# Altium schematic sheet Simetrica.SchDoc
size A4
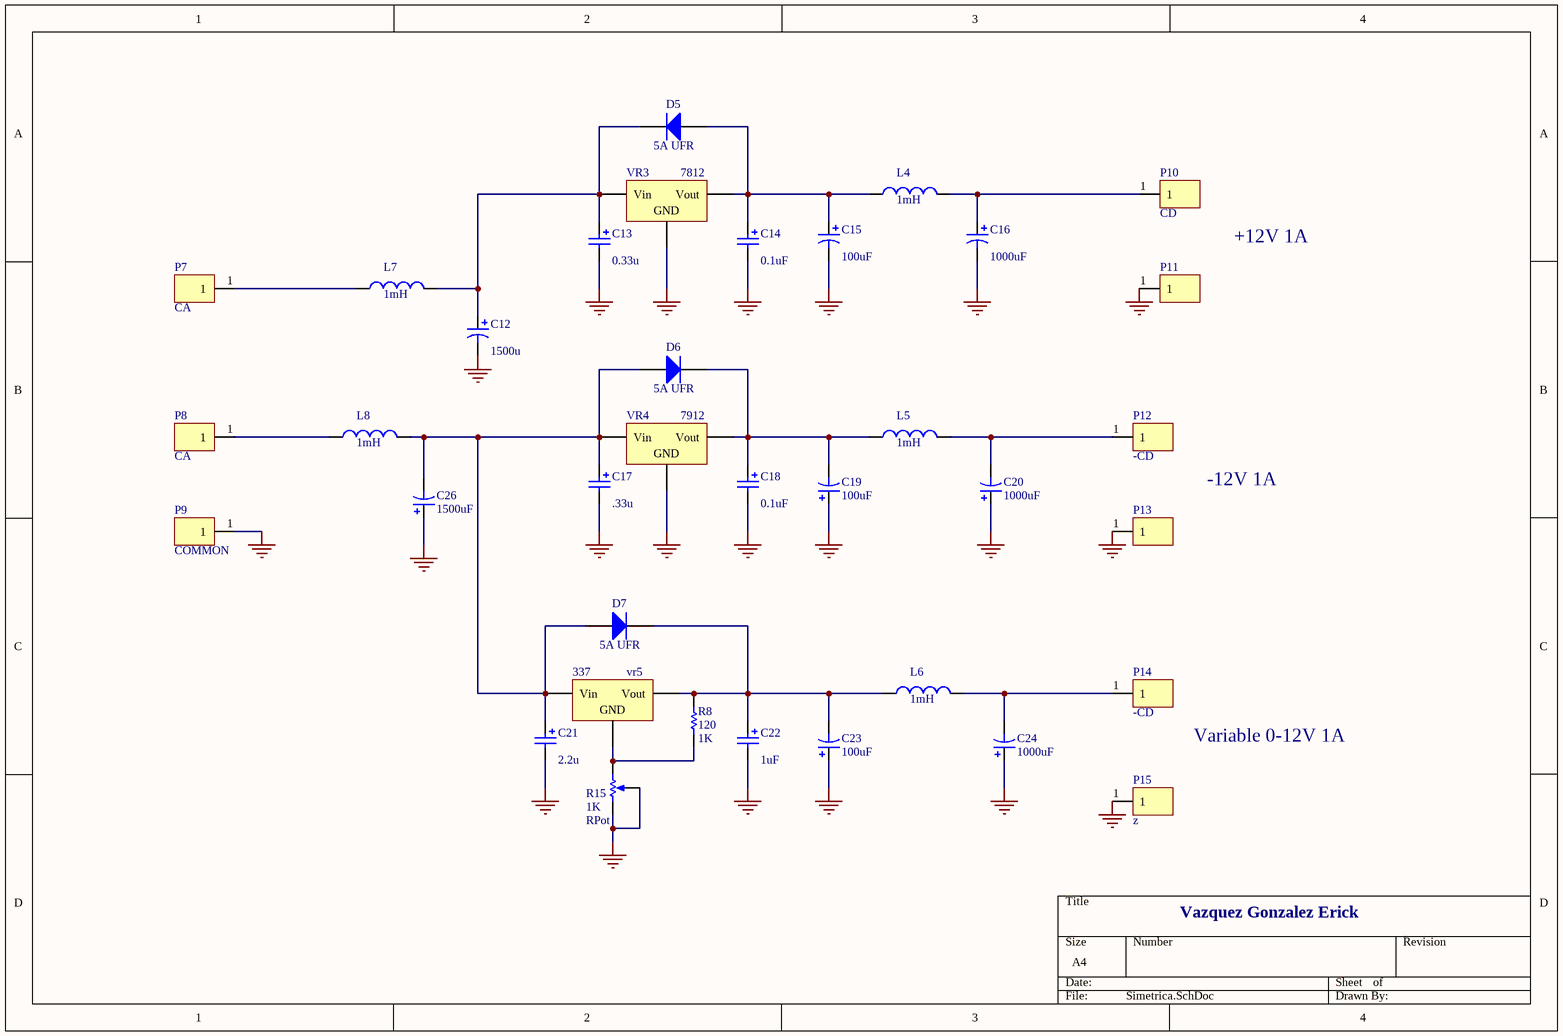
[diagram p0: Simetrica.SchDoc]

## Parts
337  vr5  [TO-220-AB]
C12  value 1500u  [CAP4700]  (hidden comment: Cap Pol1)
C13  value 0.33u  [RAD-0.1]  (hidden comment: Cap Tan)
C14  value 0.1uF  [RAD-0.1]  (hidden comment: Cap Tan)
C15  value 100uF  [RAD-0.1]  (hidden comment: Cap Pol2)
C16  value 1000uF  [CAP4700]  (hidden comment: Cap Pol1)
C17  value .33u  [RAD-0.1]  (hidden comment: Cap Tan)
C18  value 0.1uF  [RAD-0.1]  (hidden comment: Cap Tan)
C19  value 100uF  [RAD-0.1]  (hidden comment: Cap Pol2)
C20  value 1000uF  [CAP4700]  (hidden comment: Cap Pol1)
C21  value 2.2u  [RAD-0.1]  (hidden comment: Cap Tan)
C22  value 1uF  [RAD-0.1]  (hidden comment: Cap Tan)
C23  value 100uF  [RAD-0.1]  (hidden comment: Cap Pol2)
C24  value 1000uF  [CAP4700]  (hidden comment: Cap Pol1)
C26  value 1500uF  [CAP4700]  (hidden comment: Cap Pol1)
D5  5A UFR  [DO-204AL]
D6  5A UFR  [DO-204AL]
D7  5A UFR  [DO-204AL]
L4  value 1mH  [bobinita]  (hidden comment: Inductor1)
L5  value 1mH  [bobinita]  (hidden comment: Inductor1)
L6  value 1mH  [bobinita]  (hidden comment: Inductor1)
L7  value 1mH  [bobinita]  (hidden comment: Inductor1)
L8  value 1mH  [bobinita]  (hidden comment: Inductor1)
P7  CA  [cONECTOR]
P8  CA  [cONECTOR]
P9  COMMON  [cONECTOR]
P10  CD  [cONECTOR]
P11  (no value)  [cONECTOR]
P12  -CD  [cONECTOR]
P13  X  [cONECTOR]  (value not drawn)
P14  -CD  [cONECTOR]
P15  z  [cONECTOR]
R8  120  value 1K  [AXIAL-0.3]
R15  RPot  value 1K  [POT2]
VR3  7812  [TO-220-AB]
VR4  7912  [TO-220-AB]

## Nets
GND: C12.2 C13.2 C14.2 C15.2 C16.2 C17.2 C18.2 C19.1 C20.1 C21.2 C22.2 C23.1 C24.1 C26.1 P9.1 P11.1 P13.1 P15.1 R15.1(TOP) R15.3(TAP) VR3.2(GND) VR4.2(GND)
Net337_1: 337.1(Vin) C17.1 C21.1 C26.2 D6.1(A) D7.1(A) L8.2 VR4.1(Vin)
Net337_2: 337.2(GND) R8.1 R15.2(BOT)
Net337_3: 337.3(Vout) C22.1 C23.2 D7.2(K) L6.1 R8.2
NetC12_1: C12.1 C13.1 D5.2(K) L7.2 VR3.1(Vin)
NetC14_1: C14.1 C15.1 D5.1(A) L4.1 VR3.3(Vout)
NetC16_1: C16.1 L4.2 P10.1
NetC18_1: C18.1 C19.2 D6.2(K) L5.1 VR4.3(Vout)
NetC20_2: C20.2 L5.2 P12.1
NetC24_2: C24.2 L6.2 P14.1
NetL7_1: L7.1 P7.1
NetL8_1: L8.1 P8.1

## Notes on the sheet
- +12V 1A
- -12V 1A
- Variable 0-12V 1A
- Vazquez Gonzalez Erick

## Library data of the parts
337 VR4 = Volt Reg: Voltage Regulator; pin to pad: 1>2 2>1; Published: 24-Mar-1999; LatestRevisionDate: 29-May-2009; LatestRevisionNote: IPC-7351 Footprint Added.; PackageReference: D2PAK; Publisher: Altium Limited; PackageDescription: 3-Pin Transistor Outline Package 2.54 mm Pitch, 15.1 mm Lead Span
C12 C15 C16 C19 C20 C23 C24 C26 = Cap Pol1: Polarized Capacitor (Radial); Published: 8-Jun-2000; LatestRevisionDate: 17-Jul-2002; LatestRevisionNote: Re-released for DXP Platform.; PackageReference: RB7.6-15; Publisher: Altium Limited; PackageDescription: Polarized Capacitor (Radial); 2 Leads
C13 C14 C17 C18 C21 C22 = Cap Pol2: Polarized Capacitor (Axial); Published: 8-Jun-2000; LatestRevisionDate: 17-Jul-2002; LatestRevisionNote: Re-released for DXP Platform.; PackageReference: POLAR0.8; Publisher: Altium Limited; PackageDescription: Polarized Capacitor; 2 Leads
D5-D7 = Diode 1N5408: 3 Amp Medium Power Silicon Rectifier Diode; Published: 8-Jun-2000; LatestRevisionDate: 17-Jul-2002; LatestRevisionNote: Re-released for DXP Platform.; DatasheetVersion: Aug-1984; PackageReference: DO-201AD; Publisher: Altium Limited; PackageDescription: Diode, Axial; Body 9.5 x 5.3 mm (LxDia. max), Lead Dia. 1.32 mm (max); ComponentLink1Description: Manufacturer Link; ComponentLink1URL: http://www.irf.com/
L4-L8 = Inductor: Code_IEC: 1005; Published: 8-Jun-2000; LatestRevisionDate: 29-May-2009; LatestRevisionNote: IPC-7351 Footprint Added.; PackageReference: 0402-A; Publisher: Altium Limited; PackageDescription: Chip Inductor; Code_JEITA: 0402
P7-P15 = Component_1
R8 = Res1: Resistor; Published: 8-Jun-2000; LatestRevisionDate: 17-Jul-2002; LatestRevisionNote: Re-released for DXP Platform.; PackageReference: AXIAL-0.3; Publisher: Altium Limited; PackageDescription: Axial Device, Thru-Hole; 2 Leads; 0.3 in Pin Spacing
R15 = RPot: Potentiometer; Sim Note: Enter the Resistance value and the set point into parameter fields.; Set Position: 0.5; Published: 8-Jun-2000; LatestRevisionDate: 17-Jul-2002; LatestRevisionNote: Re-released for DXP Platform.; PackageReference: VR5; Publisher: Altium Limited; PackageDescription: Variable Resistor, Thru-Hole; 3 Leads
VR3 = Volt Reg: Voltage Regulator; Published: 24-Mar-1999; LatestRevisionDate: 29-May-2009; LatestRevisionNote: IPC-7351 Footprint Added.; PackageReference: D2PAK; Publisher: Altium Limited; PackageDescription: 3-Pin Transistor Outline Package 2.54 mm Pitch, 15.1 mm Lead Span